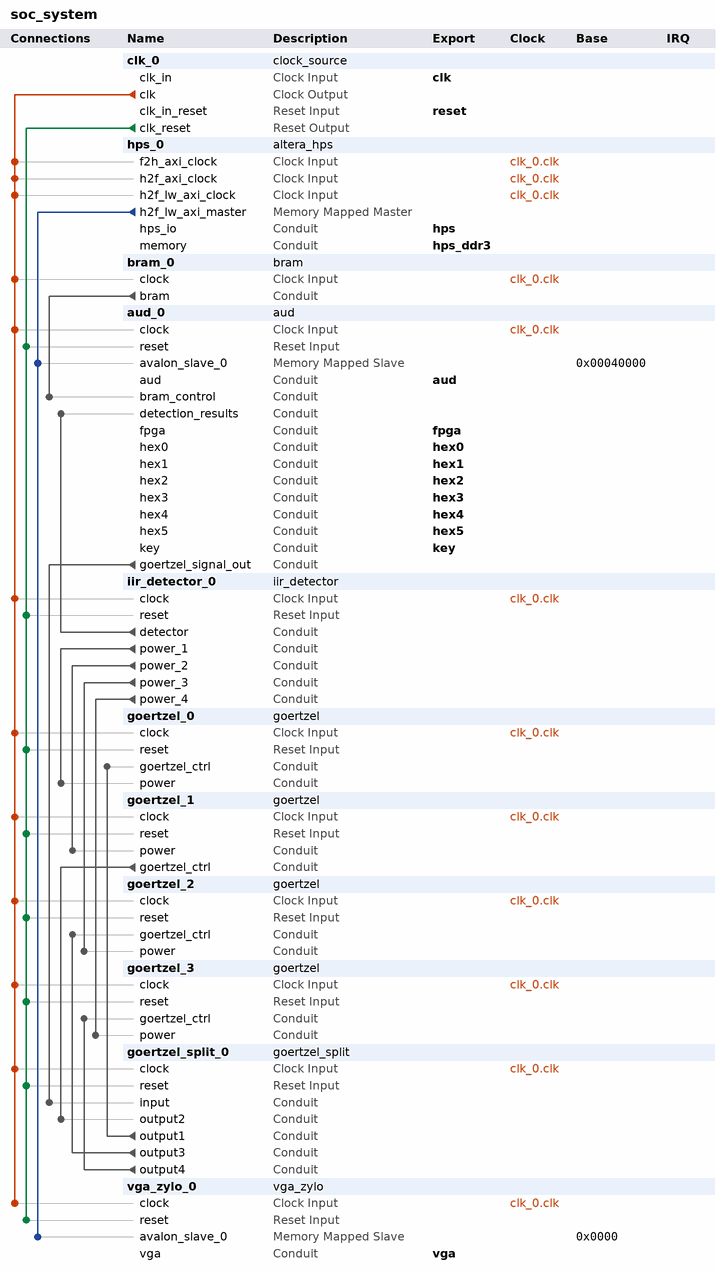
[diagram p0: system contents]
# Platform Designer (Qsys) system soc_system, Cyclone V 5CSEMA5F31C6
# Parameters at their usual value, and those the tool derives, are not listed.
package require -exact qsys 21.1
create_system soc_system
set_project_property DEVICE_FAMILY {Cyclone V}
set_project_property DEVICE 5CSEMA5F31C6

add_instance clk_0 clock_source 21.1
set_instance_parameter_value clk_0 clockFrequency 50000000

add_instance hps_0 altera_hps 21.1
set_instance_parameter_value hps_0 EMAC1_Mode RGMII
set_instance_parameter_value hps_0 EMAC1_PinMuxing {HPS I/O Set 0}
set_instance_parameter_value hps_0 F2SCLK_COLDRST_Enable false
set_instance_parameter_value hps_0 F2SCLK_DBGRST_Enable false
set_instance_parameter_value hps_0 F2SCLK_WARMRST_Enable false
set_instance_parameter_value hps_0 F2SINTERRUPT_Enable true
set_instance_parameter_value hps_0 F2S_Width 2
set_instance_parameter_value hps_0 FPGA_PERIPHERAL_OUTPUT_CLOCK_FREQ_EMAC0_GTX_CLK 125
set_instance_parameter_value hps_0 FPGA_PERIPHERAL_OUTPUT_CLOCK_FREQ_EMAC0_MD_CLK 2.5
set_instance_parameter_value hps_0 FPGA_PERIPHERAL_OUTPUT_CLOCK_FREQ_EMAC1_GTX_CLK 125
set_instance_parameter_value hps_0 FPGA_PERIPHERAL_OUTPUT_CLOCK_FREQ_EMAC1_MD_CLK 2.5
set_instance_parameter_value hps_0 HPS_PROTOCOL DDR3
set_instance_parameter_value hps_0 I2C0_Mode I2C
set_instance_parameter_value hps_0 I2C0_PinMuxing {HPS I/O Set 0}
set_instance_parameter_value hps_0 I2C1_Mode I2C
set_instance_parameter_value hps_0 I2C1_PinMuxing {HPS I/O Set 0}
set_instance_parameter_value hps_0 LWH2F_Enable true
set_instance_parameter_value hps_0 MEM_BANKADDR_WIDTH 3
set_instance_parameter_value hps_0 MEM_CLK_FREQ 400.0
set_instance_parameter_value hps_0 MEM_COL_ADDR_WIDTH 10
set_instance_parameter_value hps_0 MEM_DQ_WIDTH 32
set_instance_parameter_value hps_0 MEM_DRV_STR RZQ/7
set_instance_parameter_value hps_0 MEM_ROW_ADDR_WIDTH 15
set_instance_parameter_value hps_0 MEM_RTT_NOM RZQ/4
set_instance_parameter_value hps_0 MEM_RTT_WR RZQ/4
set_instance_parameter_value hps_0 MEM_TCL 11
set_instance_parameter_value hps_0 MEM_TFAW_NS 30.0
set_instance_parameter_value hps_0 MEM_TRAS_NS 35.0
set_instance_parameter_value hps_0 MEM_TRCD_NS 13.75
set_instance_parameter_value hps_0 MEM_TRFC_NS 260.0
set_instance_parameter_value hps_0 MEM_TRP_NS 13.75
set_instance_parameter_value hps_0 MEM_TRRD_NS 7.7
set_instance_parameter_value hps_0 MEM_VENDOR JEDEC
set_instance_parameter_value hps_0 MEM_WTCL 8
set_instance_parameter_value hps_0 QSPI_Mode N/A
set_instance_parameter_value hps_0 QSPI_PinMuxing Unused
set_instance_parameter_value hps_0 REF_CLK_FREQ 25.0
set_instance_parameter_value hps_0 S2FCLK_USER1CLK_Enable true
set_instance_parameter_value hps_0 S2FCLK_USER1CLK_FREQ 50.0
set_instance_parameter_value hps_0 S2FCLK_USER2CLK 5
set_instance_parameter_value hps_0 S2F_Width 2
set_instance_parameter_value hps_0 SDIO_Mode {4-bit Data}
set_instance_parameter_value hps_0 SDIO_PinMuxing {HPS I/O Set 0}
set_instance_parameter_value hps_0 SPIM1_Mode {Single Slave Select}
set_instance_parameter_value hps_0 SPIM1_PinMuxing {HPS I/O Set 0}
set_instance_parameter_value hps_0 STM_Enable false
set_instance_parameter_value hps_0 TIMING_BOARD_AC_SKEW 0.03
set_instance_parameter_value hps_0 TIMING_BOARD_AC_TO_CK_SKEW 0.0
set_instance_parameter_value hps_0 TIMING_BOARD_DQ_TO_DQS_SKEW 0.0
set_instance_parameter_value hps_0 TIMING_BOARD_MAX_CK_DELAY 0.03
set_instance_parameter_value hps_0 TIMING_BOARD_MAX_DQS_DELAY 0.02
set_instance_parameter_value hps_0 TIMING_BOARD_SKEW_BETWEEN_DQS 0.08
set_instance_parameter_value hps_0 TIMING_BOARD_SKEW_CKDQS_DIMM_MAX 0.16
set_instance_parameter_value hps_0 TIMING_BOARD_SKEW_CKDQS_DIMM_MIN 0.09
set_instance_parameter_value hps_0 TIMING_BOARD_SKEW_WITHIN_DQS 0.01
set_instance_parameter_value hps_0 TIMING_TDH 65
set_instance_parameter_value hps_0 TIMING_TDQSCK 255
set_instance_parameter_value hps_0 TIMING_TDQSQ 125
set_instance_parameter_value hps_0 TIMING_TDS 30
set_instance_parameter_value hps_0 TIMING_TIH 140
set_instance_parameter_value hps_0 TIMING_TIS 180
set_instance_parameter_value hps_0 TIMING_TQSH 0.4
set_instance_parameter_value hps_0 UART0_Mode {No Flow Control}
set_instance_parameter_value hps_0 UART0_PinMuxing {HPS I/O Set 0}
set_instance_parameter_value hps_0 USB1_Mode SDR
set_instance_parameter_value hps_0 USB1_PinMuxing {HPS I/O Set 0}
set_instance_parameter_value hps_0 desired_cfg_clk_mhz 50.0
set_instance_parameter_value hps_0 desired_qspi_clk_mhz 400.0

add_instance bram_0 bram 1.0
set_instance_parameter_value bram_0 RAM_ADDR_BITS 16
set_instance_parameter_value bram_0 RAM_WIDTH 24
set_instance_parameter_value bram_0 RAM_WORDS 65535

add_instance aud_0 aud 1.0
set_instance_parameter_value aud_0 readOutSize 65535

add_instance iir_detector_0 iir_detector 1.0
set_instance_parameter_value iir_detector_0 ARR_WIDTH 16

add_instance goertzel_0 goertzel 1.0
set_instance_parameter_value goertzel_0 bin_coeff 16413441

add_instance goertzel_1 goertzel 1.0
set_instance_parameter_value goertzel_1 bin_coeff 16196631

add_instance goertzel_2 goertzel 1.0
set_instance_parameter_value goertzel_2 bin_coeff 15962430

add_instance goertzel_3 goertzel 1.0
set_instance_parameter_value goertzel_3 bin_coeff 15379322

add_instance goertzel_split_0 goertzel_split 1.0

add_instance vga_zylo_0 vga_zylo 1.2

# connections
add_connection clk_0.clk aud_0.clock clock
add_connection clk_0.clk bram_0.clock clock
add_connection clk_0.clk goertzel_0.clock clock
add_connection clk_0.clk goertzel_1.clock clock
add_connection clk_0.clk goertzel_2.clock clock
add_connection clk_0.clk goertzel_3.clock clock
add_connection clk_0.clk goertzel_split_0.clock clock
add_connection clk_0.clk hps_0.f2h_axi_clock clock
add_connection clk_0.clk hps_0.h2f_axi_clock clock
add_connection clk_0.clk hps_0.h2f_lw_axi_clock clock
add_connection clk_0.clk iir_detector_0.clock clock
add_connection clk_0.clk vga_zylo_0.clock clock
add_connection clk_0.clk_reset aud_0.reset reset
add_connection clk_0.clk_reset goertzel_0.reset reset
add_connection clk_0.clk_reset goertzel_1.reset reset
add_connection clk_0.clk_reset goertzel_2.reset reset
add_connection clk_0.clk_reset goertzel_3.reset reset
add_connection clk_0.clk_reset goertzel_split_0.reset reset
add_connection clk_0.clk_reset iir_detector_0.reset reset
add_connection clk_0.clk_reset vga_zylo_0.reset reset
add_connection hps_0.h2f_lw_axi_master aud_0.avalon_slave_0 avalon
set_connection_parameter_value hps_0.h2f_lw_axi_master/aud_0.avalon_slave_0 baseAddress 0x00040000
add_connection hps_0.h2f_lw_axi_master vga_zylo_0.avalon_slave_0 avalon
set_connection_parameter_value hps_0.h2f_lw_axi_master/vga_zylo_0.avalon_slave_0 baseAddress 0x0000
add_connection aud_0.goertzel_signal_out goertzel_split_0.input conduit
add_connection bram_0.bram aud_0.bram_control conduit
add_connection goertzel_1.goertzel_ctrl goertzel_split_0.output2 conduit
add_connection goertzel_split_0.output1 goertzel_0.goertzel_ctrl conduit
add_connection goertzel_split_0.output3 goertzel_2.goertzel_ctrl conduit
add_connection goertzel_split_0.output4 goertzel_3.goertzel_ctrl conduit
add_connection iir_detector_0.detector aud_0.detection_results conduit
add_connection iir_detector_0.power_1 goertzel_0.power conduit
add_connection iir_detector_0.power_2 goertzel_1.power conduit
add_connection iir_detector_0.power_3 goertzel_2.power conduit
add_connection iir_detector_0.power_4 goertzel_3.power conduit

# exported interfaces
add_interface aud conduit end
set_interface_property aud EXPORT_OF aud_0.aud
add_interface clk clock sink
set_interface_property clk EXPORT_OF clk_0.clk_in
add_interface fpga conduit end
set_interface_property fpga EXPORT_OF aud_0.fpga
add_interface hex0 conduit end
set_interface_property hex0 EXPORT_OF aud_0.hex0
add_interface hex1 conduit end
set_interface_property hex1 EXPORT_OF aud_0.hex1
add_interface hex2 conduit end
set_interface_property hex2 EXPORT_OF aud_0.hex2
add_interface hex3 conduit end
set_interface_property hex3 EXPORT_OF aud_0.hex3
add_interface hex4 conduit end
set_interface_property hex4 EXPORT_OF aud_0.hex4
add_interface hex5 conduit end
set_interface_property hex5 EXPORT_OF aud_0.hex5
add_interface hps conduit end
set_interface_property hps EXPORT_OF hps_0.hps_io
add_interface hps_ddr3 conduit end
set_interface_property hps_ddr3 EXPORT_OF hps_0.memory
add_interface key conduit end
set_interface_property key EXPORT_OF aud_0.key
add_interface reset reset sink
set_interface_property reset EXPORT_OF clk_0.clk_in_reset
add_interface vga conduit end
set_interface_property vga EXPORT_OF vga_zylo_0.vga

set_interconnect_requirement {$system} qsys_mm.clockCrossingAdapter HANDSHAKE
set_interconnect_requirement {$system} qsys_mm.enableEccProtection FALSE
set_interconnect_requirement {$system} qsys_mm.insertDefaultSlave FALSE
set_interconnect_requirement {$system} qsys_mm.maxAdditionalLatency 1

save_system soc_system.qsys
